# EasyEDA Pro project ProPrj_cyrus_2026-03-31.epro

# Schematic Schematic1
Board Name: Board1; Create Date: 2026-03-27; Page Name: P1; Project Name: cyrus; Schematic Name: Schematic1; Update Date: 2026-03-30; Company: EasyEDA.com; Page Size: A3; Version: V1.0
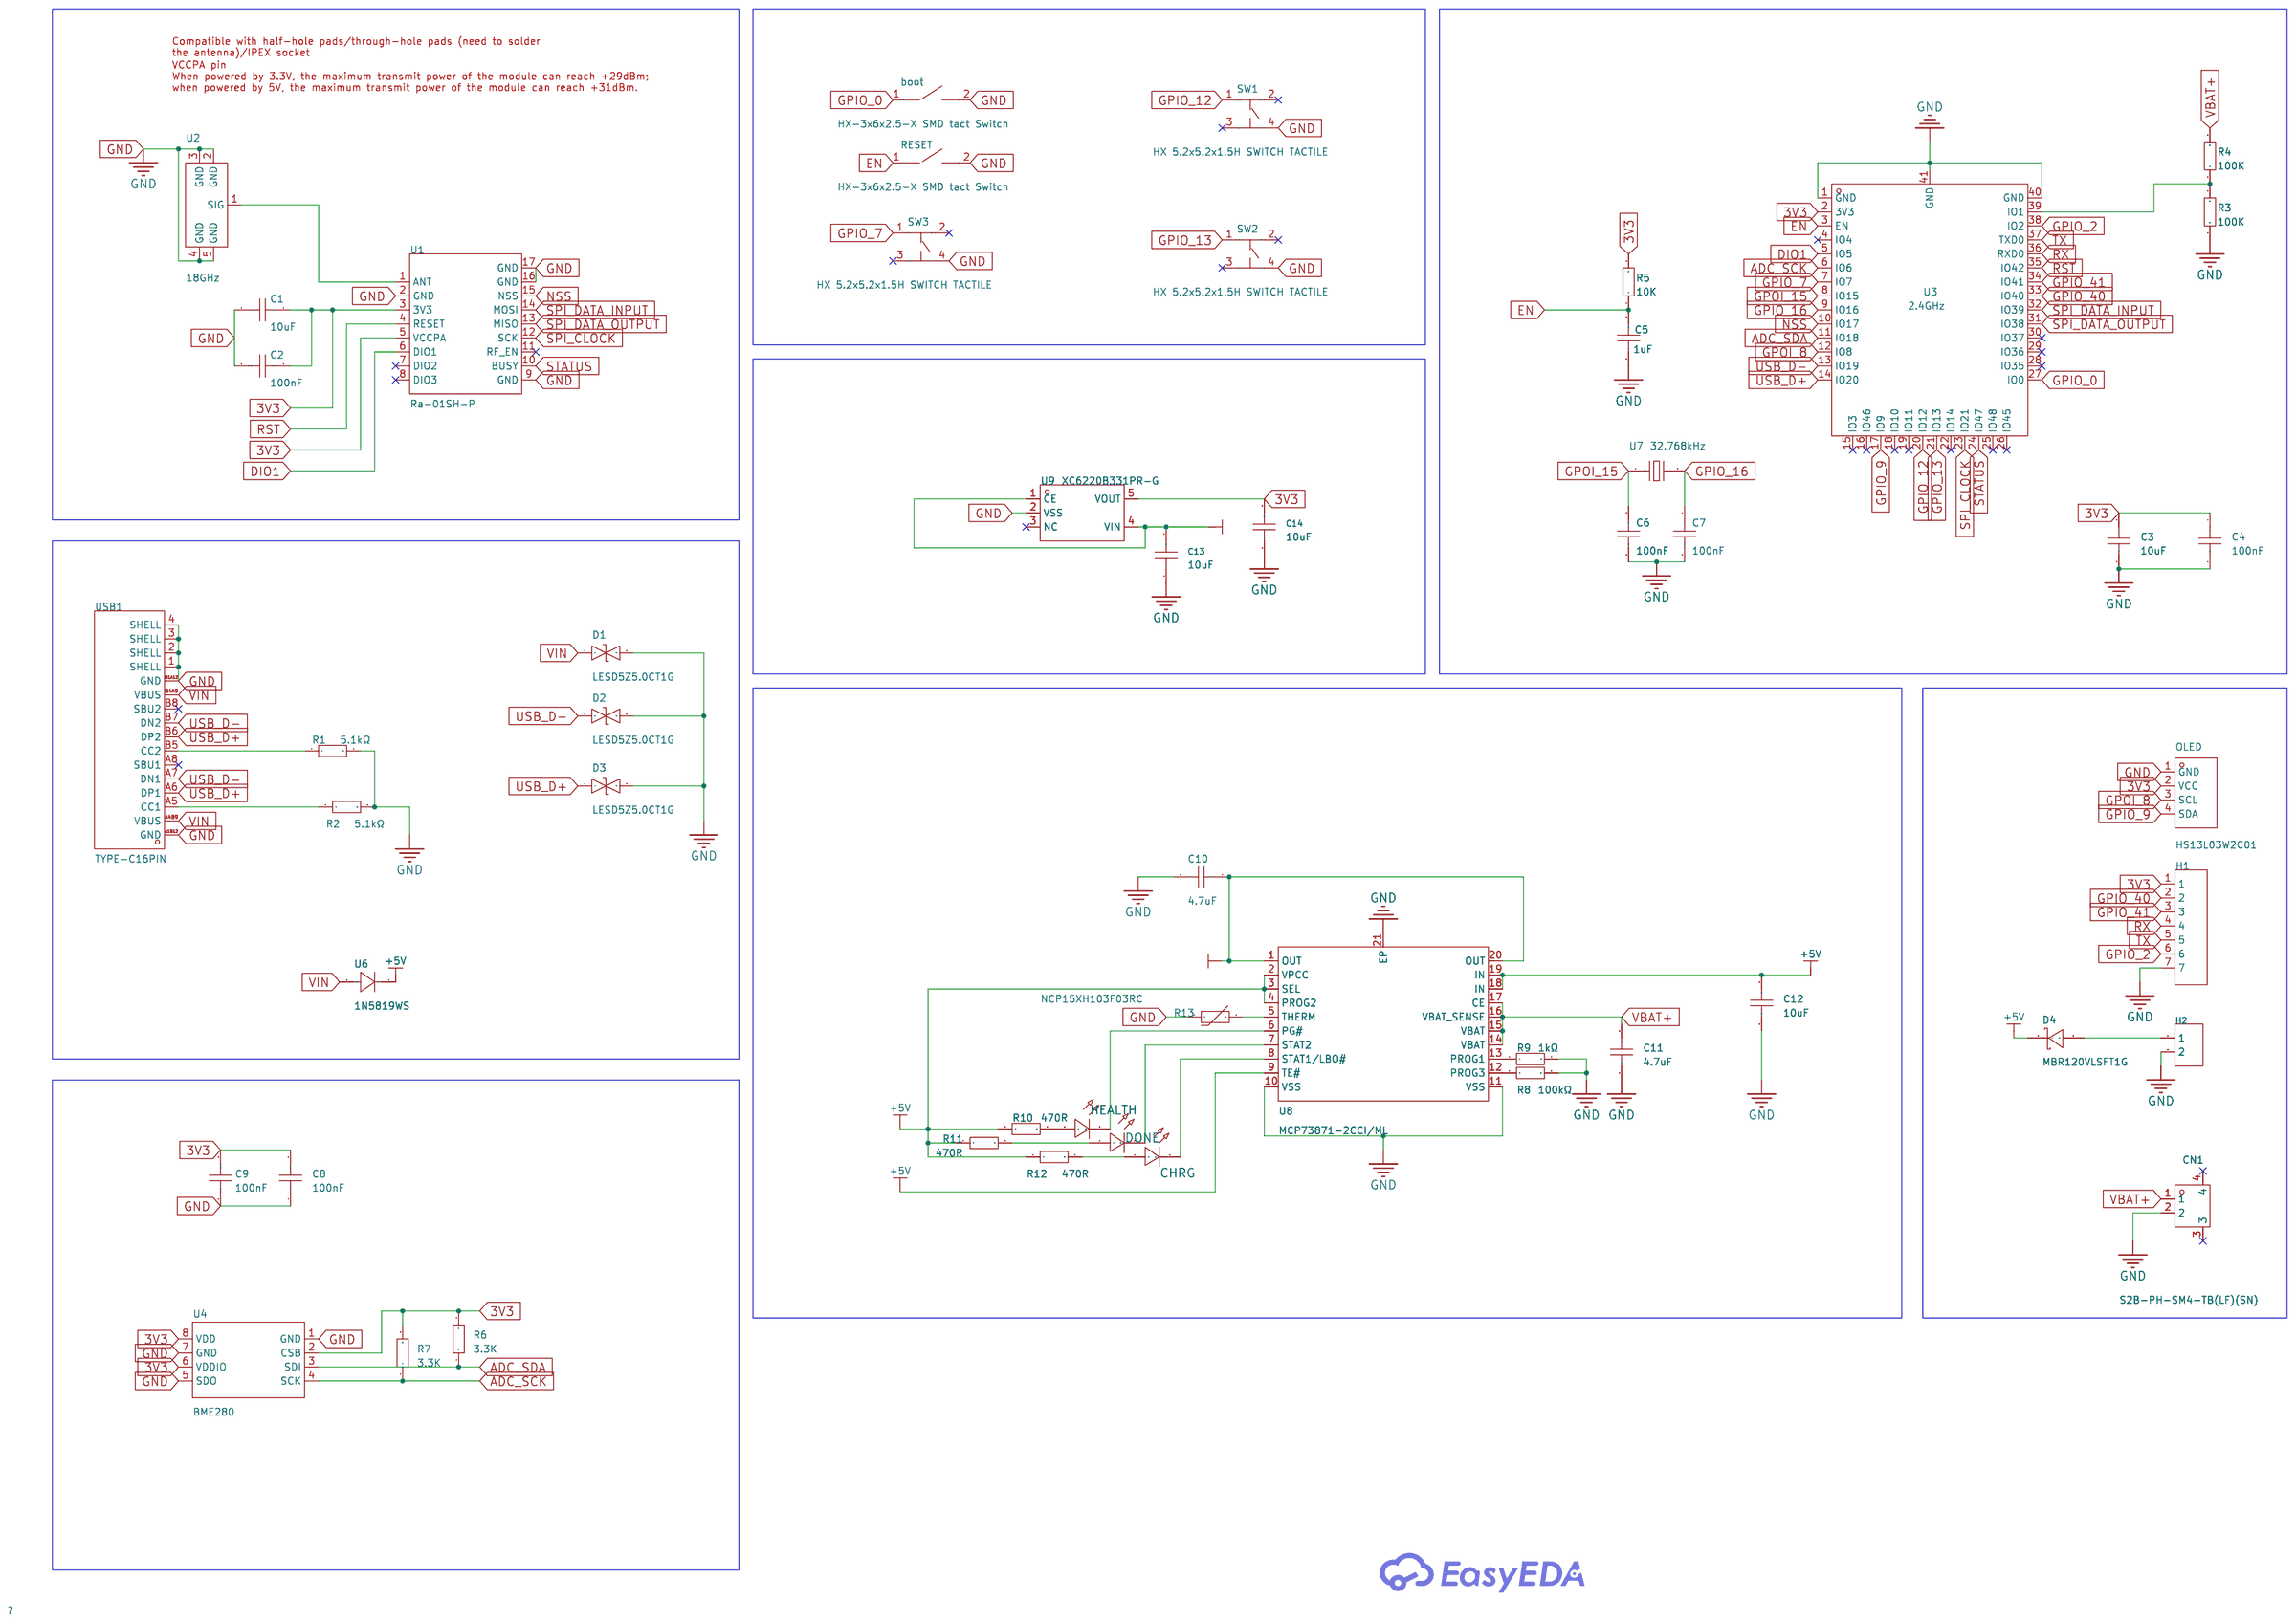
[diagram p0: schematic sheet]

## Parts
boot  HX-3x6x2.5-X SMD tact Switch  [SW-SMD_HX-3X6X2.5-X]
C1  10uF  [C0603]
C2  100nF  [C0603]
C3  10uF  [C0603]
C4  100nF  [C0603]
C5  1uF  [C0603]
C6  100nF  [C0603]
C7  100nF  [C0603]
C8  100nF  [C0603]
C9  100nF  [C0603]
C10  4.7uF  [C0402]
C11  4.7uF  [C0402]
C12  10uF  [C0402]
C13  10uF  [C0603]
C14  10uF  [C0603]
CHRG  -  [LED0603-R-RD]
CN1  S2B-PH-SM4-TB(LF)(SN)  [CONN-SMD_P2.00_S2B-PH-SM4-TB-LF-SN]
D1  LESD5Z5.0CT1G  [SOD-523_L1.2-W0.8-LS1.6-BI]
D2  LESD5Z5.0CT1G  [SOD-523_L1.2-W0.8-LS1.6-BI]
D3  LESD5Z5.0CT1G  [SOD-523_L1.2-W0.8-LS1.6-BI]
D4  MBR120VLSFT1G  [SOD-123F_L2.8-W1.8-LS3.7-RD]
DONE  -  [LED0603-R-RD]
H1  -  [HDR-TH_7P-P2.54-V-F]
H2  -  [HDR-TH_2P-P2.54-V-F]
HEALTH  -  [LED0603-R-RD]
OLED  HS13L03W2C01  [OLED-TH_L35.4-W33.5_HS13L03W2C01]
R1  5.1kΩ  [R0603]
R2  5.1kΩ  [R0603]
R3  100K  [R0603]
R4  100K  [R0603]
R5  10K  [R0603]
R6  3.3K  [R0603]
R7  3.3K  [R0603]
R8  100kΩ  [R0603]
R9  1kΩ  [R0402]
R10  470R  [R0603]
R11  470R  [R0603]
R12  470R  [R0603]
R13  NCP15XH103F03RC  [R0402]
RESET  HX-3x6x2.5-X SMD tact Switch  [SW-SMD_HX-3X6X2.5-X]
SW1  HX 5.2x5.2x1.5H SWITCH TACTILE  [SW-SMD_4P-L5.2-W5.2-P3.7-LS6.4-1]
SW2  HX 5.2x5.2x1.5H SWITCH TACTILE  [SW-SMD_4P-L5.2-W5.2-P3.7-LS6.4-1]
SW3  HX 5.2x5.2x1.5H SWITCH TACTILE  [SW-SMD_4P-L5.2-W5.2-P3.7-LS6.4-1]
U1  Ra-01SH-P  [COMM-SMD_17P-L17.0-W16.0-P2.00_RA-01S-P]
U2  18GHz  [SMA-SMD_HJ-SMA076]
U3  2.4GHz  [WIRELM-SMD_ESP32-S3-WROOM-1]
U4  BME280  [LGA-8_BME280_BL]
U6  1N5819WS  [SOD-323_L1.8-W1.3-LS2.5-RD]
U7  32.768kHz  [CRYSTAL-SMD_L3.2-W1.5-1]
U8  MCP73871-2CCI/ML  [QFN-20_L4.0-W4.0-P0.50-BL-EP2.7]
U9  XC6220B331PR-G  [SOT-89-5_L4.5-W2.5-P1.50-LS4.4-BR]
USB1  TYPE-C16PIN  [USB-C-SMD_TYPE-C16PIN]

## Library data of the parts
boot RESET = HX-3x6x2.5-X SMD tact Switch: Circuit:SPST Actuator Style:Square Button Operating Force:2.5N Mounting Type:Surface Mount,Vertical Length:6mm Width:3.6mm Switch Height:2.5mm with Bracket:Without Bracket Contact Current:50mA Voltage Rating:250V Actuator/Cap Color:White With Lamp:No IP R; LCSC Part Name: 6*3.5*2.5mm 立贴 轻触开关; Supplier Part: C49234125; Manufacturer: hanxia(韩下); Supplier Footprint: SMD,6x3.5mm; JLCPCB Part Class: Extended Part; Datasheet: https://item.szlcsc.com/datasheet/HX-3x6x2.5-X%2520SMD%2520tact%2520Switch/51650186.html; Supplier: LCSC; Circuit: SPST; Actuator Style: Square Button; Operating Force: 2.5N; Mounting Type: Surface Mount,Vertical; Length: 6mm; Width: 3.6mm; Switch Height: 2.5mm; with Bracket: Without Bracket; Contact Current: 50mA; Voltage Rating: 250V; Actuator/Cap Color: White; With Lamp: No; Termination Style: SMD(SMT) Tab; Life: 30,000 Cycles; Operating Temperature: -25℃~+70℃
C1-C7 = CAP_0603: Supplier Footprint: 0603
C8 C9 = CC0603KRX7R9BB104: Capacitance:100nF Tolerance:±10% Tolerance:±10% Voltage Rating:50V Temperature Coefficient:X7R; LCSC Part Name: 100nF ±10% 50V; Supplier Part: C14663; Manufacturer: YAGEO(国巨); Supplier Footprint: 0603; JLCPCB Part Class: Basic Part; Datasheet: https://item.szlcsc.com/datasheet/CC0603KRX7R9BB104/15331.html; Supplier: LCSC; Tolerance: ±10%; Voltage Rating: 50V; Temperature Coefficient: X7R
C10 C11 = CL05A475MP5NRNC: Capacitance:4.7uF Tolerance:±20% Tolerance:±20% Voltage Rating:10V Temperature Coefficient:X5R; LCSC Part Name: 4.7uF ±20% 10V; Supplier Part: C23733; Manufacturer: SAMSUNG(三星); Supplier Footprint: 0402; JLCPCB Part Class: Basic Part; Datasheet: https://item.szlcsc.com/datasheet/CL05A475MP5NRNC/24469.html; Supplier: LCSC; Tolerance: ±20%; Voltage Rating: 10V; Temperature Coefficient: X5R
C12 = CL05A106MP5NUNC_C315248: Capacitance:10uF Tolerance:±20% Tolerance:±20% Voltage Rating:10V Temperature Coefficient:X5R; LCSC Part Name: 10uF ±20% 10V; Supplier Part: C315248; Manufacturer: SAMSUNG(三星); Manufacturer Part: CL05A106MP5NUNC; Supplier Footprint: 0402; JLCPCB Part Class: Extended Part; Datasheet: https://item.szlcsc.com/datasheet/CL05A106MP5NUNC/297154.html; Supplier: LCSC; Tolerance: ±20%; Voltage Rating: 10V; Temperature Coefficient: X5R
C13 C14 = CL10A106MA8NRNC: Capacitance:10uF Tolerance:±20% Tolerance:±20% Voltage Rating:25V Temperature Coefficient:X5R; LCSC Part Name: 10uF ±20% 25V; Supplier Part: C96446; Manufacturer: SAMSUNG(三星); Supplier Footprint: 0603; JLCPCB Part Class: Basic Part; Datasheet: https://item.szlcsc.com/datasheet/CL10A106MA8NRNC/97651.html; Supplier: LCSC; Tolerance: ±20%; Voltage Rating: 25V; Temperature Coefficient: X5R
CHRG DONE HEALTH = LED_0603-R: Supplier Footprint: 0603
CN1 = S2B-PH-SM4-TB(LF)(SN): Pins Structure:1x2P Pitch:2mm Mounting Style:Horizontal attachment Reference Series:PH Number of Pins:2P Number of Rows:1 Number of PINs Per Row:2 Row Spacing:- Current Rating (Max):2A Contact Material:Copper alloy Contact Plating:Tin Operating Temperatur; LCSC Part Name: 1x2P 间距:2mm 卧贴 系列:PH; Supplier Part: C295747; Manufacturer: JST; Supplier Footprint: SMD,P=2mm,卧贴; JLCPCB Part Class: Extended Part; Datasheet: https://atta.szlcsc.com/upload/public/pdf/source/20210203/C295747_344B2E64535E381E727D98C302AB61C7.pdf; Supplier: LCSC; Pins Structure: 1x2P; Pitch: 2mm; Mounting Style: Horizontal attachment; Reference Series: PH; Number of Pins: 2P; Number of Rows: 1; Number of PINs Per Row: 2; Current Rating (Max): 2A; Contact Material: Copper alloy; Contact Plating: Tin; Operating Temperature Range: -25℃~+85℃; Rated Voltage (Max): 100V; Plastic Material: PA; Flame Retardant Rating: UL94V-0; Supplementary Features: Auxiliary soldering legs; Colour: Beige; Z-Height of the Board: 5.5mm; X-Length of Bottom Edge on Board (Spacing Line): 7.9mm; Y-Width of Bottom Edge on Board: 8.6mm
D1-D3 = LESD5Z5.0CT1G: Polarity:Bidirectional Reverse Stand-Off Voltage (Vrwm):5V Clamping Voltage:18.6V Peak Pulse Current (Ipp):9.4A@8/20us Peak Pulse Power Dissipation (Ppp):200W@8/20us Voltage - Breakdown:7.8V Reverse Leakage Current (Ir):1uA Operating Temperature:-40℃~+125; LCSC Part Name: 双向TVS 5V截止 峰值脉冲电流：9.4A@8/20us; Supplier Part: C136167; Manufacturer: LRC(乐山无线电); Supplier Footprint: SOD-523; JLCPCB Part Class: Extended Part; Datasheet: https://item.szlcsc.com/datasheet/LESD5Z5.0CT1G/147481.html; Supplier: LCSC; Polarity: Bidirectional; Reverse Stand-Off Voltage (Vrwm): 5V; Clamping Voltage: 18.6V; Peak Pulse Current (Ipp): 9.4A@8/20us; Peak Pulse Power Dissipation (Ppp): 200W@8/20us; Voltage - Breakdown: 7.8V; Reverse Leakage Current (Ir): 1uA; Operating Temperature: -40℃~+125℃; level of protection: IEC 61000-4-4；IEC 61000-4-2; Type: TVS; Junction Capacitance: 25pF
D4 = MBR120VLSFT1G: Diode Configuration:1 Independent Voltage - Forward(Vf@If):300mV@1A Voltage - DC Reverse(Vr):20V Current - Rectified:1A Reverse Leakage Current (Ir):600uA@20V Operating Junction Temperature Range:-65℃~+125℃ Operating Junction Temperature Range:-65℃~+125℃; LCSC Part Name: 电压:20V 电流:1A; Supplier Part: C223608; Manufacturer: onsemi(安森美); Supplier Footprint: SOD-123FL; JLCPCB Part Class: Extended Part; Datasheet: https://item.szlcsc.com/datasheet/MBR120VLSFT1G/223798.html; Supplier: LCSC; Diode Configuration: 1 Independent; Voltage - Forward(Vf@If): 300mV@1A; Voltage - DC Reverse(Vr): 20V; Current - Rectified: 1A; Reverse Leakage Current (Ir): 600uA@20V; Operating Junction Temperature Range: -65℃~+125℃; Non-Repetitive Peak Forward Surge Current: 45A
H1 = HDR-F_2.54_1x7P: Supplier Footprint: Through
H2 = HDR-F_2.54_1x2P: Supplier Footprint: Through
OLED = HS13L03W2C01: Main Control Chip:SH1106 Interface Type:I2C Size:1.3 Operating Temperature:-40℃~+70℃ Operating Temperature:-40℃~+70℃; LCSC Part Name: 1.3'1.3寸 128*64 OLED显示屏 I2C通讯 SH1106 白光; Supplier Part: C7465997; Manufacturer: HS(汉昇); JLCPCB Part Class: Extended Part; Datasheet: https://atta.szlcsc.com/upload/public/pdf/source/20230720/8731A47396DED074CDCD72E9ACEFB46F.pdf; Supplier: LCSC; Main Control Chip: SH1106; Interface Type: I2C; Size: 1.3; Operating Temperature: -40℃~+70℃
R1-R7 R10-R12 = Res_0603: Supplier Footprint: 0603
R8 = 0603WAF1003T5E: Type:Thick Film Resistor Resistance:100kΩ Tolerance:±1% Tolerance:±1% Power(Watts):100mW Voltage-Supply(Max):75V Temperature Coefficient:±100ppm/℃ Temperature Coefficient:±100ppm/℃ Operating Temperature:-55℃~+155℃ Operating Temperature:-55℃~+155℃; LCSC Part Name: 100kΩ ±1% 100mW 厚膜电阻; Supplier Part: C25803; Manufacturer: UNI-ROYAL(厚声); Supplier Footprint: 0603; JLCPCB Part Class: Basic Part; Datasheet: https://item.szlcsc.com/datasheet/0603WAF1003T5E/26546.html; Supplier: LCSC; Type: Thick Film Resistor; Tolerance: ±1%; Power(Watts): 100mW; Voltage-Supply(Max): 75V; Temperature Coefficient: ±100ppm/℃; Operating Temperature: -55℃~+155℃
R9 = 0402WGF1001TCE: Type:Thick Film Resistor Resistance:1kΩ Tolerance:±1% Tolerance:±1% Power(Watts):62.5mW Voltage-Supply(Max):50V Temperature Coefficient:±100ppm/℃ Temperature Coefficient:±100ppm/℃ Operating Temperature:-55℃~+155℃ Operating Temperature:-55℃~+155℃; LCSC Part Name: 1kΩ ±1% 62.5mW 厚膜电阻; Supplier Part: C11702; Manufacturer: UNI-ROYAL(厚声); Supplier Footprint: 0402; JLCPCB Part Class: Basic Part; Datasheet: https://item.szlcsc.com/datasheet/0402WGF1001TCE/12256.html; Supplier: LCSC; Type: Thick Film Resistor; Tolerance: ±1%; Power(Watts): 62.5mW; Voltage-Supply(Max): 50V; Temperature Coefficient: ±100ppm/℃; Operating Temperature: -55℃~+155℃
R13 = NCP15XH103F03RC: Resistance @ 25℃:10kΩ B Constant (25℃/50℃):3380K Resistance Tolerance:±1% Resistance Tolerance:±1% B Constant (25℃/75℃):- B Constant (25℃/85℃):3434K B Constant (25℃/100℃):3455K Power(Watts):100mW B Constant Tolerance:±1% Steady State Current (Max):310uA O; LCSC Part Name: 10kΩ 3380K 100mW; Supplier Part: C77131; Manufacturer: muRata(村田); Supplier Footprint: 0402; JLCPCB Part Class: Extended Part; Datasheet: https://item.szlcsc.com/datasheet/NCP15XH103F03RC/78258.html; Supplier: LCSC; Resistance @ 25℃: 10kΩ; B Constant (25℃/50℃): 3380K; Resistance Tolerance: ±1%; B Constant (25℃/85℃): 3434K; B Constant (25℃/100℃): 3455K; Power(Watts): 100mW; B Constant Tolerance: ±1%; Steady State Current (Max): 310uA; Operating Temperature: -40℃~+125℃; Dissipation Factor: 1mW/℃; Length: 1mm; Width: 0.5mm
SW1-SW3 = HX 5.2x5.2x1.5H SWITCH TACTILE: Circuit:SPST Actuator Style:Round Button Operating Force:2.5N Mounting Type:Surface Mount,Vertical Length:5.2mm Width:5.2mm Switch Height:1.5mm with Bracket:Without Bracket Contact Current:50mA Voltage Rating:12V Actuator/Cap Color:Yellow With Lamp:No IP; LCSC Part Name: 5.2*5.2*1.5mm 立贴 轻触开关; Supplier Part: C49234130; Manufacturer: hanxia(韩下); Supplier Footprint: SMD; JLCPCB Part Class: Extended Part; Datasheet: https://item.szlcsc.com/datasheet/HX%25205.2x5.2x1.5H%2520SWITCH%2520TACTILE/51650191.html; Supplier: LCSC; Circuit: SPST; Actuator Style: Round Button; Operating Force: 2.5N; Mounting Type: Surface Mount,Vertical; Length: 5.2mm; Width: 5.2mm; Switch Height: 1.5mm; with Bracket: Without Bracket; Contact Current: 50mA; Voltage Rating: 12V; Actuator/Cap Color: Yellow; With Lamp: No; Termination Style: SMD(SMT) Tab; Life: 100,000 Cycles
U1 = Ra-01SH-P: Supplier Part: C42420049; Manufacturer: Ai-Thinker(安信可); Supplier Footprint: SMD,17x16mm; JLCPCB Part Class: Extended Part; Datasheet: https://item.szlcsc.com/datasheet/Ra-01SH-P/44432713.html; Supplier: LCSC
U2 = 142-0701-801: Connector Type:Board Side Number of Ports:1 Frequency:18GHz RF Series:SMA Impedance:50Ω Rated Voltage (Max):335V Operating Temperature Range:-65℃~+165℃ Operating Temperature Range:-65℃~+165℃; LCSC Part Name: SMA; Supplier Part: C3173345; Manufacturer: belfuse; JLCPCB Part Class: Extended Part; Datasheet: https://item.szlcsc.com/datasheet/142-0701-801/3735282.html; Supplier: LCSC; Connector Type: Board Side; Number of Ports: 1; RF Series: SMA; Impedance: 50Ω; Rated Voltage (Max): 335V; Operating Temperature Range: -65℃~+165℃
U3 = ESP32-S3-WROOM-1-N8R8: Utilized IC / Part:ESP32-S3R8 Wireless Standard:Bluetooth5.0 Interface Type:I2C；GPIO；UART；SPI；USB；I2S Frequency:2.4GHz Antenna Type:On-board PCB Antenna Output Power:20.5dBm Output Power:20.5dBm Voltage - Supply:3V~3.6V Voltage - Supply:3V~3.6V Receive  C; LCSC Part Name: 不带固件 2.4GHz Wi-Fi (802.11b/g/n) + 蓝牙 5 (LE) 模组; Supplier Part: C2913201; Manufacturer: ESPRESSIF(乐鑫); Supplier Footprint: SMD,25.5x18mm; JLCPCB Part Class: Extended Part; Datasheet: https://item.szlcsc.com/datasheet/ESP32-S3-WROOM-1-N8R8/3198299.html; Supplier: LCSC; Utilized IC / Part: ESP32-S3R8; Wireless Standard: Bluetooth5.0; Interface Type: I2C；GPIO；UART；SPI；USB；I2S; Antenna Type: On-board PCB Antenna; Output Power: 20.5dBm; Voltage - Supply: 3V~3.6V; Receive  Current: 97mA; Send  Current: 330mA; Sensitivity: -104.5dBm; Operating Temperature: -40℃~+65℃
U4 = BME280: Temperature Range:-40℃~+85℃ Temperature Range:-40℃~+85℃ Humidity:0%RH~100%RH Humidity:0%RH~100%RH Interface:I2C；SPI Voltage - Supply:1.71V~3.6V Voltage - Supply:1.71V~3.6V Current - Supply:1.8uA Humidity Tolerance:±3%RH Humidity Tolerance:±3%RH Temperatur; LCSC Part Name: 湿度：0%RH~100%RH; Supplier Part: C92489; Manufacturer: Bosch(博世); Supplier Footprint: LGA-8(2.5x2.5); JLCPCB Part Class: Extended Part; Datasheet: https://item.szlcsc.com/datasheet/BME280/93682.html; Supplier: LCSC; Temperature Range: -40℃~+85℃; Humidity: 0%RH~100%RH; Interface: I2C；SPI; Voltage - Supply: 1.71V~3.6V; Current - Supply: 1.8uA; Humidity Tolerance: ±3%RH; Temperature Tolerance: ±0.5℃; Resolution: 16bit
U6 = 1N5819WS_C5451629: Diode Configuration:Independent Voltage - Forward(Vf@If):600mV@200mA Voltage - DC Reverse(Vr):40V Current - Rectified:350mA Reverse Leakage Current (Ir):5uA@30V Operating Junction Temperature Range:-40℃~+125℃ Operating Junction Temperature Range:-40℃~+125; LCSC Part Name: 电压:40V 电流:350mA; Supplier Part: C5451629; Manufacturer: HXY MOSFET(华轩阳电子); Supplier Footprint: SOD-323; JLCPCB Part Class: Extended Part; Datasheet: https://item.szlcsc.com/datasheet/1N5819WS/6355372.html; Supplier: LCSC; Diode Configuration: Independent; Voltage - Forward(Vf@If): 600mV@200mA; Voltage - DC Reverse(Vr): 40V; Current - Rectified: 350mA; Reverse Leakage Current (Ir): 5uA@30V; Operating Junction Temperature Range: -40℃~+125℃; Non-Repetitive Peak Forward Surge Current: 2A
U7 = RN32768016: Type:- Frequency:32.768kHz Normal temperature Frequency Tolerance:±20ppm Normal temperature Frequency Tolerance:±20ppm Load Capacitance:12.5pF Frequency Stability:- Frequency Stability:- Equivalent Series Resistance(ESR):- Operating Temperature:-40℃~+85℃; LCSC Part Name: 32.768kHz ±20ppm 12.5pF; Supplier Part: C7206317; Manufacturer: TROQ(创捷); Supplier Footprint: SMD3215-2P; JLCPCB Part Class: Extended Part; Datasheet: https://item.szlcsc.com/datasheet/RN32768016/8174409.html; Supplier: LCSC; Normal temperature Frequency Tolerance: ±20ppm; Load Capacitance: 12.5pF; Operating Temperature: -40℃~+85℃
U8 = MCP73871-2CCI/ML: The Chip Type:Charging IC Voltage - Supply:4.1V~6V Voltage - Supply:4.1V~6V Charge Current - Max:1.1A Charging Saturation Voltage:4.2V Type of Battery:- Number of Cells:1 Number of Cells:1 Operating Temperature:-40℃~+85℃ Operating Temperature:-40℃~+85℃ Ba; LCSC Part Name: 独立系统负载共享及锂离子/锂聚合物电池充电管理控制器; Supplier Part: C5121473; Manufacturer: MICROCHIP(美国微芯); Supplier Footprint: QFN-20(4x4); JLCPCB Part Class: Extended Part; Datasheet: https://item.szlcsc.com/datasheet/MCP73871-2CCI%252FML/5710951.html; Supplier: LCSC; The Chip Type: Charging IC; Voltage - Supply: 4.1V~6V; Charge Current - Max: 1.1A; Charging Saturation Voltage: 4.2V; Number of Cells: 1; Operating Temperature: -40℃~+85℃; Battery Temperature Detection: Support; 0V Battery Charge: Support; Supply Current (Iq): 28uA
U9 = XC6220B331PR-G: Output Type:Fixed Voltage - Supply:6V Output Voltage:3.3V Output Voltage:3.3V Output Current:1A Power Supply Rejection Ratio (PSRR):50dB@(1kHz) Voltage Dropout:655mV@(1A) standby current:18uA Features:Surge Protection；Short-Circuit  Protection；Automatic D; LCSC Part Name: 带\"GO\"功能的1A高速LDO电压稳压器; Supplier Part: C3013658; Manufacturer: TOREX(特瑞仕); Supplier Footprint: SOT-89-5; JLCPCB Part Class: Extended Part; Datasheet: https://atta.szlcsc.com/upload/public/pdf/source/20220511/F1132B42A1D8E465E8536D59E138453A.pdf; Supplier: LCSC; Output Type: Fixed; Voltage - Supply: 6V; Output Voltage: 3.3V; Output Current: 1A; Power Supply Rejection Ratio (PSRR): 50dB@(1kHz); Voltage Dropout: 655mV@(1A); standby current: 18uA; Features: Surge Protection；Short-Circuit  Protection；Automatic Discharge Function；Low ESR；Thermal Protection(TSD)；Overcurrent Protection(OCP)；With ability; Operating Temperature: -40℃~+85℃; Output Configuration: Positive electrode; Number of Outputs: 1
USB1 = TYPE-C16PIN: Connector Type:Type-C Protocol Standard:- Gender:Female Mounting Type:Surface Mount, Right Angle Number of Contacts:16P Number of Ports:1 Current Rating-Power:3A Voltage Rating:30V Connect-Disconnect Life:10,000 Cycles Supplementary Features:- Center Heig; LCSC Part Name: 16P卧贴母座; Supplier Part: C393939; Manufacturer: SHOU HAN(首韩); Supplier Footprint: SMD; JLCPCB Part Class: Extended Part; Datasheet: https://item.szlcsc.com/datasheet/TYPE-C16PIN/372551.html; Supplier: LCSC; Connector Type: Type-C; Gender: Female; Mounting Type: Surface Mount, Right Angle; Number of Contacts: 16P; Number of Ports: 1; Current Rating-Power: 3A; Voltage Rating: 30V; Connect-Disconnect Life: 10,000 Cycles; Detection color: Black; Operating Temperature: -40℃~+85℃

## Nets
3V3: C1.1 C2.1 C3.1 C4.1 C8.2 C9.2 C14.2 H1.1 OLED.2(VCC) R5.2 R6.2 R7.2 U1.3(3V3) U1.5(VCCPA) U3.2(3V3) U4.2(CSB) U4.6(VDDIO) U4.8(VDD) U9.5(VOUT)
+5V: C12.2 D4.1(K) R10.1 R11.1 R12.1 U6.1(K) U8.2(VPCC) U8.3(SEL) U8.4(PROG2) U8.9(TE#) U8.18(IN) U8.19(IN)
GND: boot.2 C1.2 C2.2 C3.2 C4.2 C5.2 C6.2 C7.2 C8.1 C9.1 C10.1 C11.1 C12.1 C13.1 C14.1 CN1.2 D1.2 D2.2 D3.2 H1.7 H2.2 OLED.1(GND) R1.2 R2.2 R3.1 R8.2 R9.2 R13.1 RESET.2 SW1.4 SW2.4 SW3.4 U1.2(GND) U1.9(GND) U1.16(GND) U1.17(GND) U2.2(GND) U2.3(GND) U2.4(GND) U2.5(GND) U3.1(GND) U3.40(GND) U3.41(GND) U4.1(GND) U4.5(SDO) U4.7(GND) U8.10(VSS) U8.11(VSS) U8.21(EP) U9.2(VSS) USB1.1(SHELL) USB1.2(SHELL) USB1.3(SHELL) USB1.4(SHELL) USB1.A1B12(GND) USB1.B1A12(GND)
VBAT+: C11.2 CN1.1 R4.2 U8.14(VBAT) U8.15(VBAT) U8.16(VBAT_SENSE) U8.17(CE)
VIN: D1.1 U6.2(A) USB1.A4B9(VBUS) USB1.B4A9(VBUS)
ADC_SCK: R7.1 U3.6(IO6) U4.4(SCK)
ADC_SDA: R6.1 U3.11(IO18) U4.3(SDI)
DIO1: U1.6(DIO1) U3.5(IO5)
EN: C5.1 R5.1 RESET.1 U3.3(EN)
GPIO_0: boot.1 U3.27(IO0)
GPIO_2: H1.6 U3.38(IO2)
GPIO_7: SW3.1 U3.7(IO7)
GPIO_9: OLED.4(SDA) U3.17(IO9)
GPIO_12: SW1.1 U3.20(IO12)
GPIO_13: SW2.1 U3.21(IO13)
GPIO_16: C7.1 U3.9(IO16) U7.2
GPIO_40: H1.2 U3.33(IO40)
GPIO_41: H1.3 U3.34(IO41)
GPOI_8: OLED.3(SCL) U3.12(IO8)
GPOI_15: C6.1 U3.8(IO15) U7.1
NSS: U1.15(NSS) U3.10(IO17)
RST: U1.4(RESET) U3.35(IO42)
RX: H1.4 U3.36(RXD0)
SPI_CLOCK: U1.12(SCK) U3.23(IO21)
SPI_DATA_INPUT: U1.14(MOSI) U3.32(IO39)
SPI_DATA_OUTPUT: U1.13(MISO) U3.31(IO38)
STATUS: U1.10(BUSY) U3.24(IO47)
TX: H1.5 U3.37(TXD0)
USB_D+: D3.1 U3.14(IO20) USB1.A6(DP1) USB1.B6(DP2)
USB_D-: D2.1 U3.13(IO19) USB1.A7(DN1) USB1.B7(DN2)
VSYS: C10.2 C13.2 U8.1(OUT) U8.20(OUT) U9.1(CE) U9.4(VIN)
$1N826: U1.1(ANT) U2.1(SIG)
$1N4212: R3.2 R4.1 U3.39(IO1)
$1N6676: D4.2(A) H2.1
$1N7941: R8.1 U8.12(PROG3)
$1N8128: R9.1 U8.13(PROG1)
$1N8308: CHRG.2(C) U8.8(STAT1/LBO#)
$1N8312: DONE.2(C) U8.7(STAT2)
$1N8319: HEALTH.2(C) U8.6(PG#)
$1N8348: HEALTH.1(A) R10.2
$1N8424: CHRG.1(A) R12.2
$1N8763: R13.2 U8.5(THERM)
$1N13542: R1.1 USB1.B5(CC2)
$1N13546: R2.1 USB1.A5(CC1)
Net-(DONE-1): DONE.1(A) R11.2

Not connected (* = marked no-connect by the designer): CN1 3* 4*; SW1 2* 3*; SW2 2* 3*; SW3 2* 3*; U1 7(DIO2)* 8(DIO3)* 11(RF_EN)*; U3 4(IO4)* 15(IO3)* 16(IO46)* 18(IO10)* 19(IO11)* 22(IO14)* 25(IO48)* 26(IO45)* 28(IO35)* 29(IO36)* 30(IO37)*; U9 3(NC)*; USB1 A8(SBU1)* B8(SBU2)*

## Notes on the sheet
- Compatible with half-hole pads/through-hole pads (need to solder
  the antenna)/IPEX socket
- VCCPA pin
  When powered by 3.3V, the maximum transmit power of the module can reach +29dBm;
  when powered by 5V, the maximum transmit power of the module can reach +31dBm.

# Board PCB1
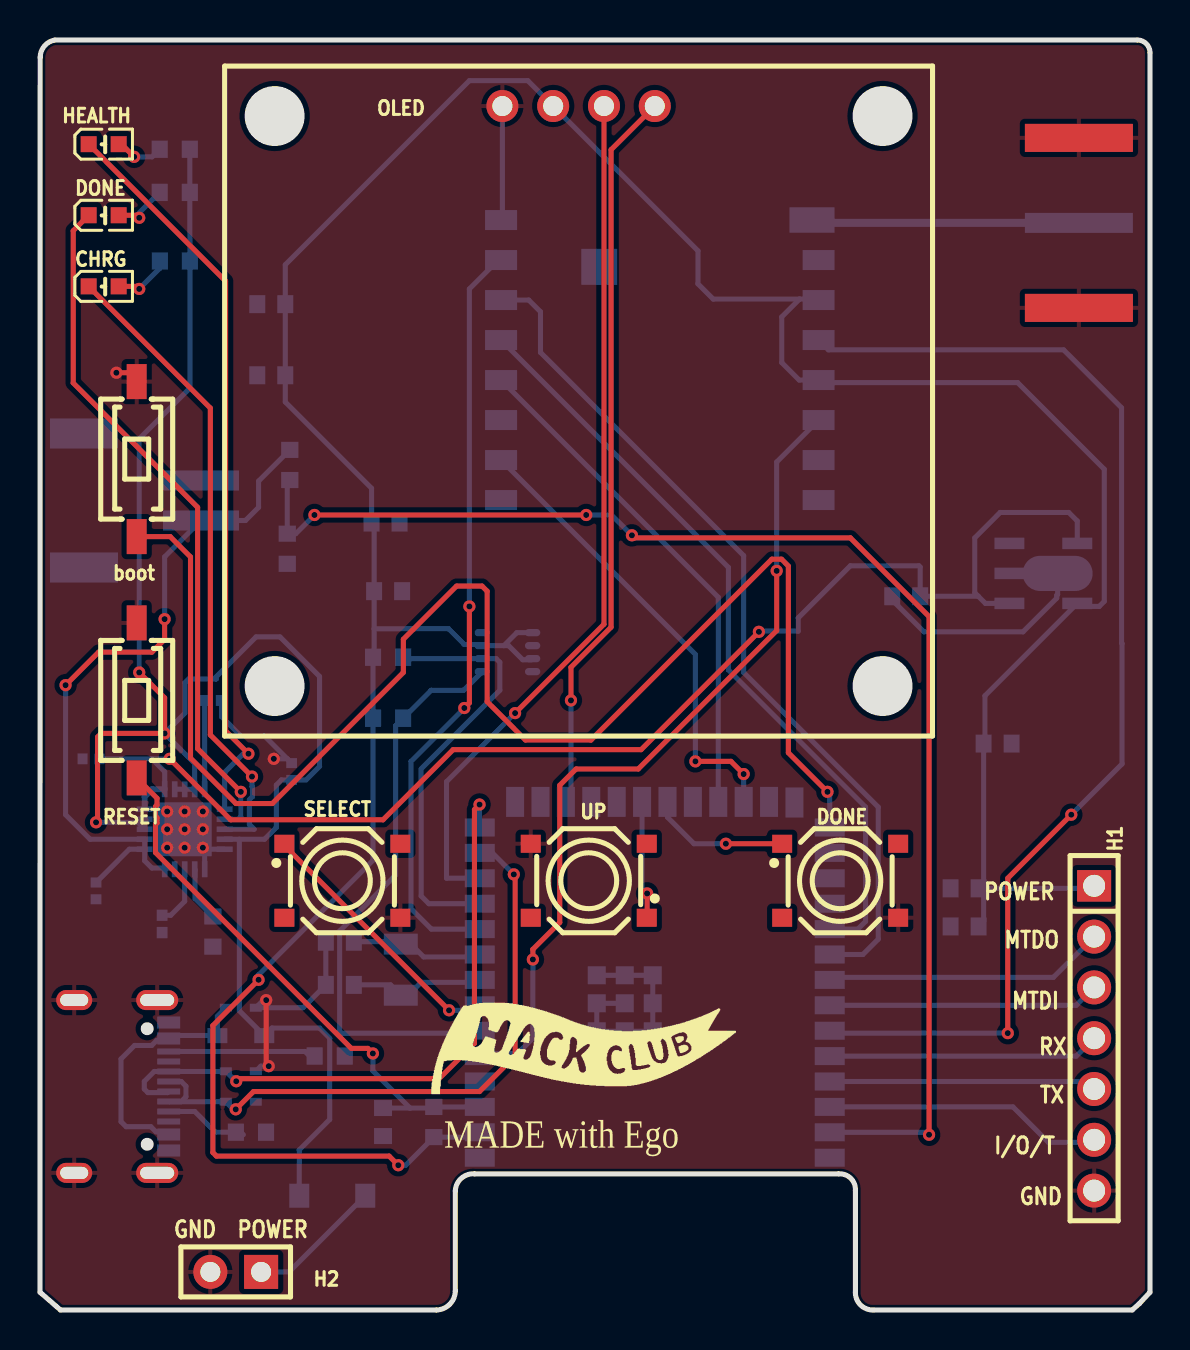
[diagram p1: board, top side]
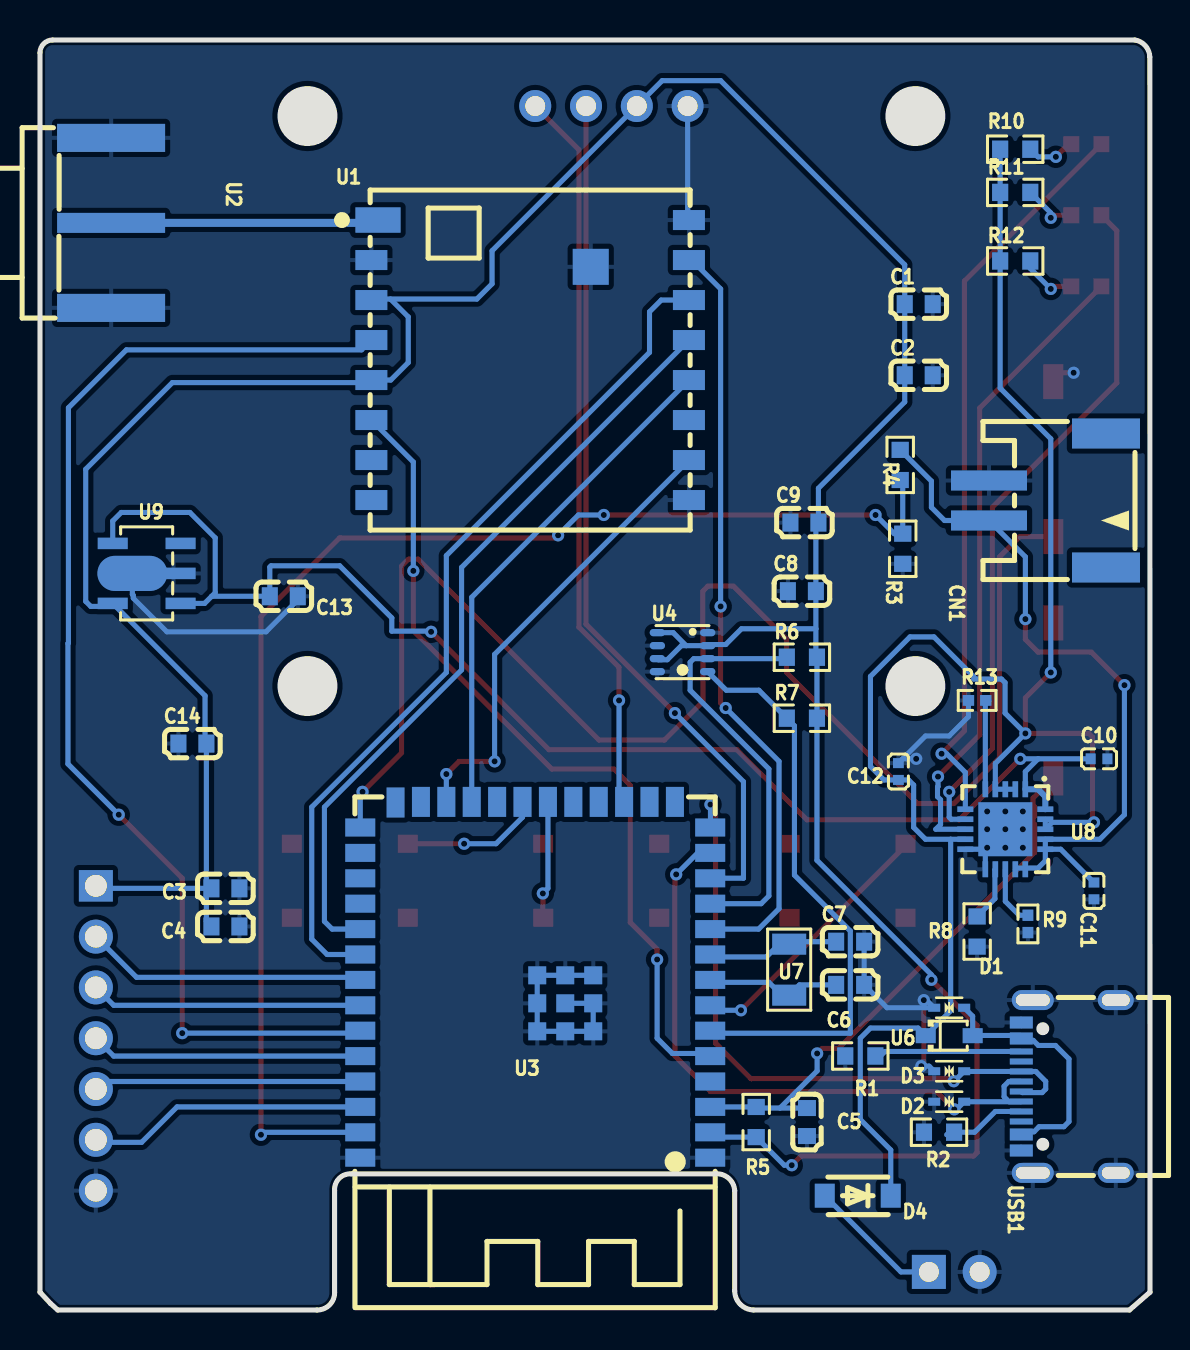
[diagram p2: board, bottom side, seen from below]

Outline 55.51 x 63.5 mm; copper layers: Top Layer, Inner1, Inner2, Inner3, Inner4, Inner5, Inner6, Inner7, Inner8, Inner9, Inner10, Inner11, Inner12, Inner13, Inner14, Inner15, Inner16, Inner17, Inner18, Inner19, Inner20, Inner21, Inner22, Inner23, Inner24, Inner25, Inner26, Inner27, Inner28, Inner29, Inner30, Bottom Layer. Coordinates in mm from the lower left corner of the outline.
Outline path: 0,0.89 0.01,62.64 arc(0.22,63.2) 0.75,63.5 54.87,63.5 arc(55.32,63.31) 55.51,62.87 55.51,0.89 54.98,0.32 54.62,0 41.67,0 arc(41.03,0.25) 40.78,0.89 40.78,5.97 arc(40.55,6.58) 39.94,6.81 21.74,6.81 arc(21.08,6.59) 20.77,5.97 20.77,0.95 arc(20.49,0.28) 19.82,0 1.03,0 0,0.89
Stack: Top Layer 0.035mm / Dielectric1 1.51mm FR4 er 4.5 / Bottom Layer 0.035mm

## Design rules (mm)
template: Custom Config
spacing copperThickness1oz (default): track to track 0.102, other pairs 0.152 to 0.3
spacing copperThickness2oz: track to track 0.203, other pairs 0.152 to 0.3
track width copperThickness1oz (default): min 0.127, default 0.254, max 2.54
track width copperThickness2oz: min 0.203, default 0.254, max 2.54
differential pair differentialPair (default): width min 0.127, default 0.254, max 2.54; gap min 0.152, default 0.152
via viaSize (default): diameter min 0.5, default 0.61, max 10; hole min 0.3, default 0.305, max 6.3

## Placement (name value [footprint] x y rotation side)
boot  HX-3x6x2.5-X SMD tact Switch  [SW-SMD_HX-3X6X2.5-X]  4.83 42.55 90 top
C1  10uF  [C0603]  11.57 50.29 180 bottom
C2  100nF  [C0603]  11.57 46.74 180 bottom
C3  10uF  [C0603]  46.24 21.08 180 bottom
C4  100nF  [C0603]  46.24 19.18 180 bottom
C5  1uF  [C0603]  17.15 9.4 270 bottom
C6  100nF  [C0603]  14.99 16.26 180 bottom
C7  100nF  [C0603]  14.99 18.42 180 bottom
C8  100nF  [C0603]  17.41 35.94 180 bottom
C9  100nF  [C0603]  17.28 39.37 180 bottom
C10  4.7uF  [C0402]  2.55 27.56 0 bottom
C11  4.7uF  [C0402]  2.8 20.96 90 bottom
C12  10uF  [C0402]  12.58 26.92 270 bottom
C13  10uF  [C0603]  43.32 35.69 0 bottom
C14  10uF  [C0603]  47.89 28.32 180 bottom
CHRG  -  [LED0603-R-RD]  3.18 51.18 0 top
CN1  S2B-PH-SM4-TB(LF)(SN)  [CONN-SMD_P2.00_S2B-PH-SM4-TB-LF-SN]  5.13 40.48 90 bottom
D1  LESD5Z5.0CT1G  [SOD-523_L1.2-W0.8-LS1.6-BI]  10.04 15.11 0 bottom
D2  LESD5Z5.0CT1G  [SOD-523_L1.2-W0.8-LS1.6-BI]  10.04 10.41 0 bottom
D3  LESD5Z5.0CT1G  [SOD-523_L1.2-W0.8-LS1.6-BI]  10.04 11.94 0 bottom
D4  MBR120VLSFT1G  [SOD-123F_L2.8-W1.8-LS3.7-RD]  14.61 5.72 0 bottom
DONE  -  [LED0603-R-RD]  3.18 54.74 0 top
DONE#2  -  [SW-SMD_4P-L5.2-W5.2-P3.7-LS6.4-1]  40.01 21.46 0 top
H1  -  [HDR-TH_7P-P2.54-V-F]  52.71 13.59 270 top
H2  -  [HDR-TH_2P-P2.54-V-F]  9.79 1.91 180 top
HEALTH  -  [LED0603-R-RD]  3.18 58.29 0 top
OLED  HS13L03W2C01  [OLED-TH_L35.4-W33.5_HS13L03W2C01]  26.93 60.2 0 top
R1  5.1kΩ  [R0603]  14.49 12.7 0 bottom
R2  5.1kΩ  [R0603]  10.55 8.89 0 bottom
R3  100K  [R0603]  12.36 38.06 90 bottom
R4  100K  [R0603]  12.49 42.25 90 bottom
R5  10K  [R0603]  19.69 9.4 270 bottom
R6  3.3K  [R0603]  17.41 32.64 180 bottom
R7  3.3K  [R0603]  17.41 29.59 180 bottom
R8  100kΩ  [R0603]  8.64 18.92 270 bottom
R9  1kΩ  [R0402]  6.11 19.3 270 bottom
R10  470R  [R0603]  6.74 58.04 180 bottom
R11  470R  [R0603]  6.74 55.88 180 bottom
R12  470R  [R0603]  6.74 52.45 180 bottom
R13  NCP15XH103F03RC  [R0402]  8.64 30.48 180 bottom
RESET  HX-3x6x2.5-X SMD tact Switch  [SW-SMD_HX-3X6X2.5-X]  4.83 30.48 90 top
SELECT  HX 5.2x5.2x1.5H SWITCH TACTILE  [SW-SMD_4P-L5.2-W5.2-P3.7-LS6.4-1]  15.12 21.46 0 top
U1  Ra-01SH-P  [COMM-SMD_17P-L17.0-W16.0-P2.00_RA-01S-P]  31 47.5 180 bottom
U2  18GHz  [SMA-SMD_HJ-SMA076]  51.95 54.36 90 bottom
U3  2.4GHz  [WIRELM-SMD_ESP32-S3-WROOM-1]  30.74 16.51 0 bottom
U4  BME280  [LGA-8_BME280_BL]  23.38 32.89 180 bottom
U6  1N5819WS  [SOD-323_L1.8-W1.3-LS2.5-RD]  10.04 13.72 180 bottom
U7  32.768kHz  [CRYSTAL-SMD_L3.2-W1.5-1]  18.04 17.02 90 bottom
U8  MCP73871-2CCI/ML  [QFN-20_L4.0-W4.0-P0.50-BL-EP2.7]  7.23 24.04 0 bottom
U9  XC6220B331PR-G  [SOT-89-5_L4.5-W2.5-P1.50-LS4.4-BR]  50.17 36.83 180 bottom
UP   -  [SW-SMD_4P-L5.2-W5.2-P3.7-LS6.4-1]  27.44 21.46 180 top
USB1  TYPE-C16PIN  [USB-C-SMD_TYPE-C16PIN]  4.07 11.18 90 bottom

## Footprints (pads in the part's own frame, mm; a bottom-side part is the same pattern mirrored in y, then rotated)
C0402
  rect 0.5x0.54 smd: 1(-0.42,0) 2(0.42,0)
C0603
  rect 0.8x0.9 smd: 1(-0.7,0) 2(0.7,0)
COMM-SMD_17P-L17.0-W16.0-P2.00_RA-01S-P
  rect 2.26x1.27 smd: 1(-7.61,7)
  rect 1.6x1 smd: 2(-7.94,5) 3(-7.94,3) 4(-7.94,1) 5(-7.94,-1) 6(-7.94,-3) 7(-7.94,-5) 8(-7.94,-7) 9(7.94,-7) 10(7.94,-5) 11(7.94,-3) 12(7.94,-1) 13(7.94,1) 14(7.94,3) 15(7.94,5) 16(7.94,7)
  rect 1.8x1.8 smd: 17(3.03,4.66)
CONN-SMD_P2.00_S2B-PH-SM4-TB-LF-SN
  rect 1x3.8 smd: 1(-1,2.925) 2(1,2.925)
  rect 1.5x3.4 smd: 3(3.35,-2.925) 4(-3.35,-2.925)
CRYSTAL-SMD_L3.2-W1.5-1
  rect 1.05x1.7 smd: 1(-1.275,0) 2(1.275,0)
HDR-TH_2P-P2.54-V-F
  rect 1.7x1.7 hole 1: 1(-1.27,0)
  round 1.7 hole 1: 2(1.27,0)
HDR-TH_7P-P2.54-V-F
  rect 1.575x1.7 hole 1.1: 1(-7.62,0)
  round 1.7 hole 1.1: 2(-5.08,0) 3(-2.54,0) 4(0,0) 5(2.54,0) 6(5.08,0) 7(7.62,0)
LED0603-R-RD
  rect 0.8x0.8 smd: 1(0.751,0) 2(-0.751,0)
LGA-8_BME280_BL
  oval 0.767x0.364 smd: 1(1.258,0.975) 2(1.258,0.325) 3(1.258,-0.325) 4(1.258,-0.975) 5(-1.258,-0.975) 6(-1.258,-0.325) 7(-1.258,0.325) 8(-1.258,0.975)
OLED-TH_L35.4-W33.5_HS13L03W2C01
  round 1.6 hole 1: 1(-3.81,0) 2(-1.27,0) 3(1.27,0) 4(3.81,0)
QFN-20_L4.0-W4.0-P0.50-BL-EP2.7
  rect 0.28x0.8 smd: 1(-1,-2) 2(-0.5,-2) 3(0,-2) 4(0.5,-2) 5(1,-2) 11(1,2) 12(0.5,2) 13(0,2) 14(-0.5,2) 15(-1,2)
  rect 0.8x0.28 smd: 6(2,-1) 7(2,-0.5) 8(2,0) 9(2,0.5) 10(2,1) 16(-2,1) 17(-2,0.5) 18(-2,0) 19(-2,-0.5) 20(-2,-1)
  rect 2.7x2.7 smd: 21(0,0)
R0402
  rect 0.566x0.54 smd: 1(-0.433,0) 2(0.433,0)
R0603
  rect 0.806x0.864 smd: 1(-0.753,0) 2(0.753,0)
SMA-SMD_HJ-SMA076
  rect 1x5.4 smd: 1(0,0)
  rect 1.4x5.4 smd: 2(-4.25,0) 3(4.25,0)
  rect 1.4x5.4 smd far side: 4(-4.25,0) 5(4.25,0)
SOD-123F_L2.8-W1.8-LS3.7-RD
  rect 1x1.2 smd: 1(-1.65,0) 2(1.65,0)
SOD-323_L1.8-W1.3-LS2.5-RD
  rect 1x0.75 smd: 1(-1.173,0) 2(1.173,0)
SOD-523_L1.2-W0.8-LS1.6-BI
  rect 0.6x0.4 smd: 1(-0.75,0) 2(0.75,0)
SOT-89-5_L4.5-W2.5-P1.50-LS4.4-BR
  rect 1.5x0.574 smd: 1(1.698,-1.5) 3(1.698,1.5) 4(-1.698,1.5) 5(-1.698,-1.5)
  oval 3.5x1.76 smd: 2(-0.715,0)
  rect 2.209x0.574 smd: 2(1.343,0)
SW-SMD_4P-L5.2-W5.2-P3.7-LS6.4-1
  rect 1x0.9 smd: 1(-2.9,1.85) 2(2.9,1.85) 3(-2.9,-1.85) 4(2.9,-1.85)
SW-SMD_HX-3X6X2.5-X
  rect 1.75x1 smd: 1(-3.875,0) 2(3.875,0)
USB-C-SMD_TYPE-C16PIN
  oval 1x2.1 hole 0.6x1.7: 1(-4.32,1.788) 2(4.32,1.788)
  oval 1x1.8 hole 0.6x1.4: 3(-4.32,-2.362) 4(4.32,-2.362)
  rect 0.6x1.15 smd: A1B12(-3.2,2.362) A4B9(-2.4,2.362) B1A12(3.2,2.362) B4A9(2.4,2.362)
  rect 0.3x1.15 smd: A5(-1.25,2.362) A6(-0.25,2.362) A7(0.25,2.362) A8(1.25,2.362) B5(1.75,2.362) B6(0.75,2.362) B7(-0.75,2.362) B8(-1.75,2.362)
WIRELM-SMD_ESP32-S3-WROOM-1
  rect 1.5x0.9 smd: 1(-8.75,8.895) 2(-8.75,7.625) 3(-8.75,6.355) 4(-8.75,5.085) 5(-8.75,3.815) 6(-8.75,2.545) 7(-8.75,1.275) 8(-8.75,0.005) 9(-8.75,-1.265) 10(-8.75,-2.535) 11(-8.75,-3.805) 12(-8.75,-5.075) 13(-8.75,-6.345) 14(-8.75,-7.615) 27(8.75,-7.615) 28(8.75,-6.345) 29(8.75,-5.075) 30(8.75,-3.805) 31(8.75,-2.535) 32(8.75,-1.265) 33(8.75,0.005) 34(8.75,1.275) 35(8.75,2.545) 36(8.75,3.815) 37(8.75,5.085) 38(8.75,6.355) 39(8.75,7.625) 40(8.75,8.895)
  rect 0.9x1.5 smd: 15(-6.985,-8.895) 16(-5.715,-8.895) 17(-4.445,-8.895) 18(-3.175,-8.895) 19(-1.905,-8.895) 20(-0.635,-8.895) 21(0.635,-8.895) 22(1.905,-8.895) 23(3.175,-8.895) 24(4.445,-8.895) 25(5.715,-8.895) 26(6.985,-8.865)
  rect 0.9x0.9 smd: 41(-2.9,-0.225) 41(-2.9,1.175) 41(-2.9,2.575) 41(-1.5,-0.225) 41(-1.5,1.175) 41(-1.5,2.575) 41(-0.1,-0.225) 41(-0.1,1.175) 41(-0.1,2.575)

## Nets
As in the schematic, except:
GND: boot.2 C1.2 C2.2 C3.2 C4.2 C5.2 C6.2 C7.2 C8.1 C9.1 C10.1 C11.1 C12.1 C13.1 C14.1 CN1.2 D1.2 D2.2 D3.2 DONE#2.4 H1.7 H2.2 OLED.1 R1.2 R2.2 R3.1 R8.2 R9.2 R13.1 RESET.2 SELECT.4 U1.2 U1.9 U1.16 U1.17 U2.2 U2.3 U2.4 U2.5 U3.1 U3.40 U3.41 U4.1 U4.5 U4.7 U8.10 U8.11 U8.21 U9.2 UP .4 USB1.1 USB1.2 USB1.3 USB1.4 USB1.A1B12 USB1.B1A12
GPIO_7: SELECT.1 U3.7
GPIO_12: U3.20 UP .1
GPIO_13: DONE#2.1 U3.21
$1N8428: DONE.1 R11.2

Pads without a net: CN1 3 4; DONE#2 2 3; SELECT 2 3; U1 7 8 11; U3 4 15 16 18 19 22 25 26 28 29 30; U9 3; UP  2 3; USB1 A8 B8

## Via types
v1: diameter 0.61, hole 0.305, Top Layer to Bottom Layer, 51 vias

## Routing (per net, layer and track width the routed paths; a pad name or vN(x,y) marks a point on that pad's centre or on a via; arc(x,y) is an arc through that point)
3V3: length 164.2
  Top Layer w0.254: v1(10.93,16.51) 8.64,14.22 8.64,7.87 8.82,7.69 17.46,7.69 v1(17.92,7.24)
  Bottom Layer w0.254: v1(17.92,7.24) 18.29,7.24 R5.2 21.75,8.64 U3.2 ; v1(10.93,16.51) 10.93,16.76 16.65,22.49 R7.2 R6.2 16.71,32.69 16.71,34.06 ; 47.19,21.08 52.59,21.08 H1.1 ; 47.19,21.08 C14.2 47.25,28.39 47.25,30.71 U9.5 52.02,35.18 52.97,35.18 53.22,35.43 53.22,42.04 48.89,46.37 39.06,46.37 U1.5 37.97,46.5 37.09,47.37 37.09,49.66 37.98,50.55 ; 47.19,21.08 C3.1 ; 47.19,21.08 47.19,19.43 C4.1 ; 16.71,34.06 C8.2 16.71,39.24 C9.2 16.58,41.09 12.27,45.4 12.27,52.26 21.47,61.47 24.39,61.47 OLED.2 32.9,52.96 32.9,51.31 33.66,50.55 37.98,50.55 ; 16.71,34.06 20.43,34.06 21.22,33.27 22.06,33.27 U4.2 23.19,33.22 ; 23.19,33.22 23.84,33.87 U4.8 ; 23.19,33.22 23.43,33.22 24.14,32.51 24.58,32.51 U4.6 ; 37.98,50.55 38.89,50.55 U1.3
+5V: length 92
  Top Layer w0.254: v1(2.8,24.38) 2.88,24.46 2.88,28.65 3.06,28.83 v1(6.23,28.83) 6.23,30.61 v1(4.96,31.88)
  Bottom Layer w0.254: v1(4.96,31.88) 4.96,43.56 7.49,46.09 R12.1 R11.1 R10.1 ; U8.19 U8.18 4.89,24.38 v1(2.8,24.38) ; U8.2 U8.3 U8.4 7.73,27.33 v1(6.23,28.83) 7.25,29.85 7.25,31.37 7.43,31.55 8.81,31.55 8.81,31.66 10.8,33.66 12,33.66 13.98,31.68 13.98,27.18 13.3,26.5 C12.2 12.07,26.5 11.82,26.25 11.82,24.13 11.23,23.54 9.97,23.54 ; 12.96,5.72 12.96,8 14.49,9.53 14.49,13.59 13.98,14.1 11.6,14.1 U6.1 9.97,14.96 9.97,23.54 ; 9.97,23.54 U8.9
GND: length 48.8
  Top Layer w0.254: v1(11.44,12.19) 11.31,12.32 v1(11.31,15.49) ; v1(3.82,46.86) 4.39,46.86 boot.2
  Bottom Layer w0.254: 12.37,27.56 11.22,28.7 10.04,28.7 9.08,29.67 R13.1 ; 12.37,27.56 C12.1 ; 12.37,27.56 v1(11.69,27.56) ; 8.22,23.04 8.23,23.02 U8.11 ; 8.22,23.04 v1(8.14,23.11) ; 8.22,23.04 U8.10 ; 6.45,14.22 6.45,14.53 ; v1(11.44,12.19) 11.05,12.19 D3.2 ; U3.41 U3.41 U3.41 U3.41 U3.41 U3.41 U3.41 U3.41 U3.41 ; U9.2 50.89,35.78 50.84,35.73 50.84,35.59 49.16,33.91 44.2,33.91 42.62,35.5 C13.1 ; v1(11.31,15.49) 11.17,15.49 D1.2 13.15,15.11 C6.2 C7.2 ; OLED.1 23.12,54.56 U1.16 ; 6.45,8.14 6.45,7.83
  vias: v1(6.36,24.93) v1(6.36,24.04) v1(6.36,23.11) v1(7.23,24.93) v1(7.23,24.04) v1(7.23,23.11) v1(8.14,24.93) v1(8.14,24.04)
VBAT+: length 36.1
  Top Layer w0.254: v1(1.28,31.24) 2.93,32.89 5.6,32.89 6.23,33.53 v1(6.23,34.54)
  Bottom Layer w0.254: U8.16 4.47,23.04 C11.2 ; U8.16 U8.17 2.51,23.54 1.28,24.77 v1(1.28,31.24) ; U8.16 5.23,22.46 5.6,22.1 6.67,22.1 U8.14 ; 12.49,43.01 10.93,41.45 10.93,40.13 10.27,39.48 CN1.1 6.23,37.66 v1(6.23,34.54)
VIN: length 12.6
  Bottom Layer w0.254: D1.1 8.87,14.69 U6.2 8.86,13.73 6.45,13.73 ; 6.44,13.7 6.18,13.7 5.96,13.48 5.84,13.48 5.59,13.23 4.73,13.23 4.05,12.55 4.05,9.42 4.31,9.17 5.55,9.17 5.8,8.91 6.17,8.91 6.18,8.9 6.44,8.9
ADC_SCK: length 29
  Bottom Layer w0.254: 22.12,31.92 21.19,30.99 19.56,30.99 R7.1 17.78,29.21 17.78,21.75 14.99,18.95 14.99,13.85 15,13.84 21.87,13.84 U3.6
ADC_SDA: length 21.3
  Bottom Layer w0.254: U3.11 19.45,20.32 19.06,20.7 19.06,27.05 23,30.99 23,32.39 22.81,32.57 U4.3 18.23,32.57 R6.1
DIO1: length 41.7
  Top Layer w0.254: v1(24.65,17.53) 24.65,18.03 25.99,19.38 25.99,26.24 26.81,27.05 29.92,27.05 36.84,33.97 v1(36.84,36.96)
  Bottom Layer w0.254: v1(36.84,36.96) 36.84,42.4 U1.6 ; v1(24.65,17.53) 24.65,13.59 23.89,12.83 22.12,12.83 U3.5
EN: length 27.6
  Top Layer w0.254: v1(16.65,12.83) 16.39,13.08 15.57,13.08 5.78,22.87 5.78,24.28 5.85,24.36 5.85,24.61 5.78,24.69 5.78,25.17 5.85,25.25 5.85,25.59 RESET.1
  Bottom Layer w0.254: U3.3 21.99,10.15 R5.1 19.64,10.1 18.5,10.1 ; C5.1 18.5,10.1 ; 18.5,10.1 16.65,11.95 v1(16.65,12.83)
GPIO_0: length 73.7
  Top Layer w0.254: boot.1 6.51,38.67 7.53,37.65 7.53,27.6 9.8,25.32 11.62,25.32 18.17,31.88 18.17,33.54 20.83,36.2 22.11,36.2 22.36,35.94 22.36,30.42 24.28,28.5 27.55,28.5 36.6,37.54 37.08,37.54 37.42,37.2 37.42,27.86 v1(39.38,25.91)
  Bottom Layer w0.254: v1(39.38,25.91) 39.49,25.79 U3.27
GPIO_2: length 14
  Bottom Layer w0.254: H1.6 52.59,8.38 50.43,8.38 48.65,10.16 U3.38
GPIO_7: length 13.6
  Top Layer w0.254: 12.22,23.57 12.22,23.22 v1(20.46,14.99)
  Bottom Layer w0.254: v1(20.46,14.99) 21.74,14.99 U3.7
GPIO_9: length 36.6
  Top Layer w0.254: OLED.4 28.56,58.01 28.56,34.14 26.55,32.14 v1(26.55,30.48)
  Bottom Layer w0.254: v1(26.55,30.48) 26.55,25.66 U3.17
GPIO_12: length 5.9
  Top Layer w0.254: UP .1 30.36,19.63 v1(30.36,20.83)
  Bottom Layer w0.254: 30.11,25.41 30.11,21.08 v1(30.36,20.83)
GPIO_13: length 7.1
  Top Layer w0.254: DONE#2.1 v1(34.3,23.31)
  Bottom Layer w0.254: v1(34.3,23.31) 32.7,23.31 31.38,24.64 U3.21
GPIO_16: length 6.7
  Bottom Layer w0.254: U3.9 21.87,17.65 19.19,17.65 18.55,18.29 U7.2 17.92,18.42 C7.1
GPIO_40: length 14.1
  Bottom Layer w0.254: U3.33 39.62,16.63 50.68,16.63 H1.2
GPIO_41: length 13.6
  Bottom Layer w0.254: U3.34 51.82,15.24 H1.3
GPOI_8: length 43.5
  Top Layer w0.254: OLED.3 28.2,34.29 v1(23.76,29.85)
  Bottom Layer w0.254: v1(23.76,29.85) 20.33,26.42 20.33,21.59 21.99,21.59 U3.12
GPOI_15: length 6.8
  Bottom Layer w0.254: C6.1 17.53,16.26 U7.1 18.42,15.74 19.06,16.38 21.87,16.38 U3.8
NSS: length 38.2
  Top Layer w0.254: v1(21.22,30.1) 21.47,30.35 v1(21.47,35.18)
  Bottom Layer w0.254: U3.10 19.57,19.05 18.55,20.07 18.55,27.43 v1(21.22,30.1) ; U1.15 22.92,52.5 21.47,51.05 v1(21.47,35.18)
RST: length 59.2
  Top Layer w0.254: v1(48.4,13.84) 48.4,21.59 v1(51.57,24.77)
  Bottom Layer w0.254: v1(48.4,13.84) 39.61,13.84 U3.35 ; v1(51.57,24.77) 54.11,27.31 54.11,33.32 54.09,33.35 54.09,45.11 51.19,48.01 39.43,48.01 U1.4
RX: length 13.6
  Bottom Layer w0.254: U3.36 51.82,12.7 H1.4
SPI_CLOCK: length 25.6
  Bottom Layer w0.254: U3.23 33.92,35.64 U1.12
SPI_DATA_INPUT: length 43.3
  Bottom Layer w0.254: U3.32 41.15,17.78 41.92,18.54 41.92,25.15 35.19,31.88 35.19,37.72 25.03,47.88 25.03,49.91 24.44,50.5 U1.14
SPI_DATA_OUTPUT: length 38.6
  Bottom Layer w0.254: U3.31 40.9,19.05 41.28,19.43 41.28,25.15 34.43,32 34.43,37.13 U1.13
STATUS: length 23.2
  Top Layer w0.254: v1(35.19,26.8) 34.55,27.43 v1(32.77,27.43)
  Bottom Layer w0.254: U1.10 32.77,32.78 v1(32.77,27.43) ; v1(35.19,26.8) U3.24
TX: length 13.4
  Bottom Layer w0.254: H1.5 52.34,11.43 U3.37
USB_D+: length 32.5
  Top Layer w0.254: v1(21.98,25.27) 21.73,25.02 21.73,13.34 19.96,11.57 9.94,11.57 v1(9.81,11.44)
  Bottom Layer w0.254: v1(21.98,25.27) 21.98,24.14 U3.14 ; D3.1 9.79,11.44 v1(9.81,11.44) ; 9.18,11.93 USB1.B6 5.71,11.93 5.22,11.43 5.22,11.05 5.4,10.87 6.38,10.87 USB1.A6
USB_D-: length 31.7
  Top Layer w0.254: v1(9.79,10.03) 10.68,10.92 21.98,10.92 23.76,12.7 23.76,21.71 v1(23.69,21.78)
  Bottom Layer w0.254: 7.05,10.41 7.3,10.66 7.3,11.19 7.06,11.43 6.45,11.43 ; 7.05,10.41 D2.1 9.67,10.03 v1(9.79,10.03) ; 7.05,10.41 6.46,10.41 6.45,10.43 ; U3.13 22.62,22.86 v1(23.69,21.78)
VSYS: length 67.6
  Top Layer w0.254: v1(6.49,27.56) 9.53,24.51 17.15,24.51 20.66,28.02 30.06,28.02 v1(35.95,33.91)
  Bottom Layer w0.254: U9.4 51.87,39.45 51.44,39.88 48.02,39.88 46.74,38.61 46.74,35.86 46.92,35.69 ; 46.92,35.69 C13.2 44.02,37.15 43.95,37.21 40.52,37.21 37.92,34.6 37.92,33.94 35.98,33.94 v1(35.95,33.91) ; 46.92,35.69 47.28,35.33 U9.1 ; U8.1 6.23,26.92 5.59,27.56 ; 5.59,27.56 C10.2 ; 5.59,27.56 v1(6.49,27.56)
  Bottom Layer w0.3: U8.1 5.6,26.04 5.23,25.67 U8.20
$1N826: length 13.4
  Bottom Layer w0.4: U1.1 38.75,54.36 U2.1
$1N4212: length 68.2
  Top Layer w0.254: v1(27.31,39.75) v1(13.73,39.75) ; v1(44.46,8.76) 44.46,34.67 40.52,38.61 29.73,38.61 v1(29.6,38.74)
  Bottom Layer w0.254: U3.39 44.34,8.89 v1(44.46,8.76) ; v1(27.31,39.75) 28.58,39.75 v1(29.6,38.74) ; R4.1 12.36,41.37 R3.2 12.79,38.82 v1(13.73,39.75)
$1N6676: length 6.8
  Bottom Layer w0.254: D4.2 12.45,1.91 H2.1
$1N7941: length 2.7
  Bottom Layer w0.254: U8.12 7.76,22.02 7.76,20.57 R8.1
$1N8128: length 3
  Bottom Layer w0.254: U8.13 7.23,20.43 6.54,19.74 R9.1
$1N8308: length 32.2
  Top Layer w0.254: CHRG.2 8.52,45.1 8.52,28.75 v1(10.6,26.67)
  Bottom Layer w0.254: v1(10.6,26.67) 10.6,26.18 10.63,26.15 10.63,25.67 10.47,25.51 10.47,24.28 10.71,24.04 U8.8
$1N8312: length 34.7
  Top Layer w0.254: DONE.2 1.66,53.96 1.66,46.36 7.88,40.13 7.88,28.07 v1(10.04,25.91)
  Bottom Layer w0.254: v1(10.04,25.91) 10.04,24.64 9.94,24.54 U8.7
$1N8319: length 37.2
  Top Layer w0.254: v1(10.42,27.81) 9.28,28.96 9.28,51.45 HEALTH.2
  Bottom Layer w0.254: v1(10.42,27.81) 10.17,27.81 9.23,26.88 U8.6
$1N8348: length 2.5
  Top Layer w0.254: v1(4.71,57.66) 4.07,58.29 HEALTH.1
  Bottom Layer w0.254: R10.2 5.61,57.66 v1(4.71,57.66)
$1N8424: length 2.9
  Top Layer w0.254: v1(4.96,51.05) 4.83,51.18 CHRG.1
  Bottom Layer w0.254: R12.2 5.99,52.08 v1(4.96,51.05)
$1N8428: length 2.8
  Top Layer w0.254: DONE.1 4.83,54.74 v1(4.96,54.61)
  Bottom Layer w0.254: R11.2 4.96,54.86 v1(4.96,54.61)
$1N8763: length 4.5
  Bottom Layer w0.254: 8.06,30.48 8.23,30.31 U8.5
$1N13542: length 7.5
  Bottom Layer w0.254: 13.73,12.45 13.25,12.93 USB1.B5
$1N13546: length 4.2
  Bottom Layer w0.254: 10.17,8.76 10.04,8.89 8.77,8.89 7.74,9.93 USB1.A5

## Copper pours and planes (outline as drawn; the poured copper is in the pictures)
GND on Top Layer: -0.25,63.63 55.76,63.63 55.76,-0.25 -0.25,-0.25
GND on Bottom Layer: -0.37,63.75 55.89,63.75 55.89,-0.25 -0.37,-0.25

## Text on the board
Top Silkscreen Layer: GND | POWER | I/O/T | MTDO | MTDI | RX | TX | MADE with Ego
